# Altium schematic sheet Motor.SchDoc
size A
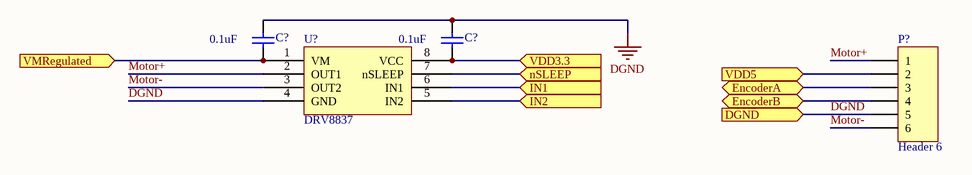
[diagram p0: Motor.SchDoc]

## Parts
(Parts that share a designator on the sheet are numbered #1, #2 ... from top to bottom, then left to right.)
C?#1  value 0.1uF  [RAD-0.3]
C?#2  value 0.1uF  [RAD-0.3]
P?  Header 6  [HDR1X6]
U?  DRV8837

## Ports
DGND (in), EncoderA, EncoderB, IN1 (in), IN2 (in), nSLEEP (in), VDD3.3 (in), VDD5 (in), VMRegulated (in)

## Nets
DGND: C?#1.2 C?#2.2 P?.5 U?.4(GND) ; port DGND
EncoderA: P?.3 ; port EncoderA
EncoderB: P?.4 ; port EncoderB
IN1: U?.6(IN1) ; port IN1
IN2: U?.5(IN2) ; port IN2
Motor+: P?.1 U?.2(OUT1)
Motor-: P?.6 U?.3(OUT2)
nSLEEP: U?.7(nSLEEP) ; port nSLEEP
VDD3.3: C?#2.1 U?.8(VCC) ; port VDD3.3
VDD5: P?.2 ; port VDD5
VMRegulated: C?#1.1 U?.1(VM) ; port VMRegulated

## Library data of the parts
C?#1 C?#2 = Cap: Capacitor; Published: 8-Jun-2000; LatestRevisionDate: 17-Jul-2002; LatestRevisionNote: Re-released for DXP Platform.; PackageReference: RAD-0.3; Publisher: Altium Limited; PackageDescription: Radial Cap, Thru-Hole; 2 Leads; 0.3 in Pin Spacing
P? = Header 6: Header, 6-Pin; LatestRevisionDate: 17-Jul-2002; LatestRevisionNote: Re-released for DXP Platform.; Publisher: Altium Limited